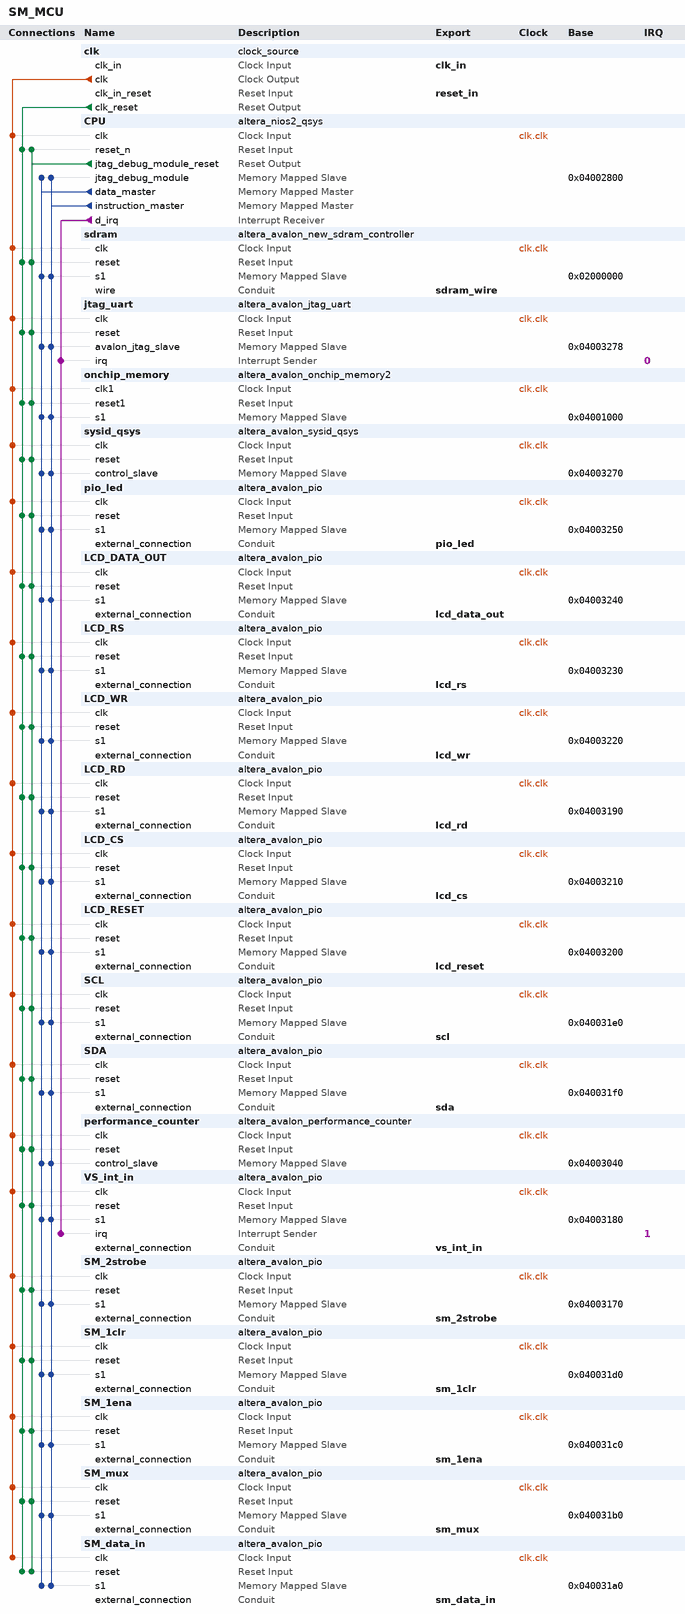
[diagram p0: system contents]
# Platform Designer (Qsys) system SM_MCU, Cyclone IV E EP4CE22F17C6
# Parameters at their usual value, and those the tool derives, are not listed.
package require -exact qsys 14.0
create_system SM_MCU
set_project_property DEVICE_FAMILY {Cyclone IV E}
set_project_property DEVICE EP4CE22F17C6

add_instance clk clock_source 14.0
set_instance_parameter_value clk clockFrequency 75000000

add_instance CPU altera_nios2_qsys 14.0
set_instance_parameter_value CPU resetrequest_enabled true
set_instance_parameter_value CPU resetSlave sdram.s1
set_instance_parameter_value CPU mmu_TLBMissExcSlave None
set_instance_parameter_value CPU exceptionSlave sdram.s1
set_instance_parameter_value CPU breakSlave CPU.jtag_debug_module
set_instance_parameter_value CPU impl Fast
set_instance_parameter_value CPU icache_size 4096

add_instance sdram altera_avalon_new_sdram_controller 14.0
set_instance_parameter_value sdram TAC 5.5
set_instance_parameter_value sdram TRCD 20.0
set_instance_parameter_value sdram TRP 20.0
set_instance_parameter_value sdram casLatency 3
set_instance_parameter_value sdram columnWidth 9
set_instance_parameter_value sdram dataWidth 16
set_instance_parameter_value sdram generateSimulationModel false
set_instance_parameter_value sdram initRefreshCommands 8
set_instance_parameter_value sdram model single_Micron_MT48LC4M32B2_7_chip
set_instance_parameter_value sdram numberOfBanks 4
set_instance_parameter_value sdram numberOfChipSelects 1
set_instance_parameter_value sdram powerUpDelay 200.0
set_instance_parameter_value sdram refreshPeriod 7.8125
set_instance_parameter_value sdram rowWidth 13

add_instance jtag_uart altera_avalon_jtag_uart 14.0
set_instance_parameter_value jtag_uart simInteractiveOptions NO_INTERACTIVE_WINDOWS

add_instance onchip_memory altera_avalon_onchip_memory2 14.0
set_instance_parameter_value onchip_memory dataWidth 32
set_instance_parameter_value onchip_memory dualPort false
set_instance_parameter_value onchip_memory initMemContent true
set_instance_parameter_value onchip_memory initializationFileName onchip_mem.hex
set_instance_parameter_value onchip_memory memorySize 4096

add_instance sysid_qsys altera_avalon_sysid_qsys 14.0
set_instance_parameter_value sysid_qsys id 0

add_instance pio_led altera_avalon_pio 14.0
set_instance_parameter_value pio_led direction Output
set_instance_parameter_value pio_led resetValue 1
set_instance_parameter_value pio_led width 2

add_instance LCD_DATA_OUT altera_avalon_pio 14.0
set_instance_parameter_value LCD_DATA_OUT direction Output
set_instance_parameter_value LCD_DATA_OUT width 16

add_instance LCD_RS altera_avalon_pio 14.0
set_instance_parameter_value LCD_RS direction Output
set_instance_parameter_value LCD_RS width 1

add_instance LCD_WR altera_avalon_pio 14.0
set_instance_parameter_value LCD_WR direction Output
set_instance_parameter_value LCD_WR width 1

add_instance LCD_RD altera_avalon_pio 14.0
set_instance_parameter_value LCD_RD direction Output
set_instance_parameter_value LCD_RD width 1

add_instance LCD_CS altera_avalon_pio 14.0
set_instance_parameter_value LCD_CS direction Output
set_instance_parameter_value LCD_CS width 1

add_instance LCD_RESET altera_avalon_pio 14.0
set_instance_parameter_value LCD_RESET direction Output
set_instance_parameter_value LCD_RESET width 1

add_instance SCL altera_avalon_pio 14.0
set_instance_parameter_value SCL direction Output
set_instance_parameter_value SCL resetValue 1
set_instance_parameter_value SCL width 1

add_instance SDA altera_avalon_pio 14.0
set_instance_parameter_value SDA direction Bidir
set_instance_parameter_value SDA resetValue 1
set_instance_parameter_value SDA width 1

add_instance performance_counter altera_avalon_performance_counter 14.0
set_instance_parameter_value performance_counter numberOfSections 3

add_instance VS_int_in altera_avalon_pio 14.0
set_instance_parameter_value VS_int_in bitClearingEdgeCapReg true
set_instance_parameter_value VS_int_in captureEdge true
set_instance_parameter_value VS_int_in direction Input
set_instance_parameter_value VS_int_in edgeType FALLING
set_instance_parameter_value VS_int_in generateIRQ true
set_instance_parameter_value VS_int_in irqType EDGE
set_instance_parameter_value VS_int_in width 2

add_instance SM_2strobe altera_avalon_pio 14.0
set_instance_parameter_value SM_2strobe direction Output
set_instance_parameter_value SM_2strobe width 1

add_instance SM_1clr altera_avalon_pio 14.0
set_instance_parameter_value SM_1clr direction Output
set_instance_parameter_value SM_1clr resetValue 1
set_instance_parameter_value SM_1clr width 1

add_instance SM_1ena altera_avalon_pio 14.0
set_instance_parameter_value SM_1ena direction Output
set_instance_parameter_value SM_1ena width 1

add_instance SM_mux altera_avalon_pio 14.0
set_instance_parameter_value SM_mux direction Output
set_instance_parameter_value SM_mux width 2

add_instance SM_data_in altera_avalon_pio 14.0
set_instance_parameter_value SM_data_in direction Input
set_instance_parameter_value SM_data_in simDrivenValue 69905
set_instance_parameter_value SM_data_in width 32

# connections
add_connection clk.clk CPU.clk clock
add_connection clk.clk jtag_uart.clk clock
add_connection clk.clk LCD_CS.clk clock
add_connection clk.clk LCD_DATA_OUT.clk clock
add_connection clk.clk LCD_RD.clk clock
add_connection clk.clk LCD_RESET.clk clock
add_connection clk.clk LCD_RS.clk clock
add_connection clk.clk LCD_WR.clk clock
add_connection clk.clk onchip_memory.clk1 clock
add_connection clk.clk performance_counter.clk clock
add_connection clk.clk pio_led.clk clock
add_connection clk.clk SCL.clk clock
add_connection clk.clk SDA.clk clock
add_connection clk.clk sdram.clk clock
add_connection clk.clk SM_1clr.clk clock
add_connection clk.clk SM_1ena.clk clock
add_connection clk.clk SM_2strobe.clk clock
add_connection clk.clk SM_data_in.clk clock
add_connection clk.clk SM_mux.clk clock
add_connection clk.clk sysid_qsys.clk clock
add_connection clk.clk VS_int_in.clk clock
add_connection clk.clk_reset CPU.reset_n reset
add_connection clk.clk_reset jtag_uart.reset reset
add_connection clk.clk_reset LCD_CS.reset reset
add_connection clk.clk_reset LCD_DATA_OUT.reset reset
add_connection clk.clk_reset LCD_RD.reset reset
add_connection clk.clk_reset LCD_RESET.reset reset
add_connection clk.clk_reset LCD_RS.reset reset
add_connection clk.clk_reset LCD_WR.reset reset
add_connection clk.clk_reset onchip_memory.reset1 reset
add_connection clk.clk_reset performance_counter.reset reset
add_connection clk.clk_reset pio_led.reset reset
add_connection clk.clk_reset SCL.reset reset
add_connection clk.clk_reset SDA.reset reset
add_connection clk.clk_reset sdram.reset reset
add_connection clk.clk_reset SM_1clr.reset reset
add_connection clk.clk_reset SM_1ena.reset reset
add_connection clk.clk_reset SM_2strobe.reset reset
add_connection clk.clk_reset SM_data_in.reset reset
add_connection clk.clk_reset SM_mux.reset reset
add_connection clk.clk_reset sysid_qsys.reset reset
add_connection clk.clk_reset VS_int_in.reset reset
add_connection CPU.jtag_debug_module_reset CPU.reset_n reset
add_connection CPU.jtag_debug_module_reset jtag_uart.reset reset
add_connection CPU.jtag_debug_module_reset LCD_CS.reset reset
add_connection CPU.jtag_debug_module_reset LCD_DATA_OUT.reset reset
add_connection CPU.jtag_debug_module_reset LCD_RD.reset reset
add_connection CPU.jtag_debug_module_reset LCD_RESET.reset reset
add_connection CPU.jtag_debug_module_reset LCD_RS.reset reset
add_connection CPU.jtag_debug_module_reset LCD_WR.reset reset
add_connection CPU.jtag_debug_module_reset onchip_memory.reset1 reset
add_connection CPU.jtag_debug_module_reset performance_counter.reset reset
add_connection CPU.jtag_debug_module_reset pio_led.reset reset
add_connection CPU.jtag_debug_module_reset SCL.reset reset
add_connection CPU.jtag_debug_module_reset SDA.reset reset
add_connection CPU.jtag_debug_module_reset sdram.reset reset
add_connection CPU.jtag_debug_module_reset SM_1clr.reset reset
add_connection CPU.jtag_debug_module_reset SM_1ena.reset reset
add_connection CPU.jtag_debug_module_reset SM_2strobe.reset reset
add_connection CPU.jtag_debug_module_reset SM_data_in.reset reset
add_connection CPU.jtag_debug_module_reset SM_mux.reset reset
add_connection CPU.jtag_debug_module_reset sysid_qsys.reset reset
add_connection CPU.jtag_debug_module_reset VS_int_in.reset reset
add_connection CPU.data_master CPU.jtag_debug_module avalon
set_connection_parameter_value CPU.data_master/CPU.jtag_debug_module baseAddress 0x04002800
add_connection CPU.data_master jtag_uart.avalon_jtag_slave avalon
set_connection_parameter_value CPU.data_master/jtag_uart.avalon_jtag_slave baseAddress 0x04003278
add_connection CPU.data_master LCD_CS.s1 avalon
set_connection_parameter_value CPU.data_master/LCD_CS.s1 baseAddress 0x04003210
add_connection CPU.data_master LCD_DATA_OUT.s1 avalon
set_connection_parameter_value CPU.data_master/LCD_DATA_OUT.s1 baseAddress 0x04003240
add_connection CPU.data_master LCD_RD.s1 avalon
set_connection_parameter_value CPU.data_master/LCD_RD.s1 baseAddress 0x04003190
add_connection CPU.data_master LCD_RESET.s1 avalon
set_connection_parameter_value CPU.data_master/LCD_RESET.s1 baseAddress 0x04003200
add_connection CPU.data_master LCD_RS.s1 avalon
set_connection_parameter_value CPU.data_master/LCD_RS.s1 baseAddress 0x04003230
add_connection CPU.data_master LCD_WR.s1 avalon
set_connection_parameter_value CPU.data_master/LCD_WR.s1 baseAddress 0x04003220
add_connection CPU.data_master onchip_memory.s1 avalon
set_connection_parameter_value CPU.data_master/onchip_memory.s1 baseAddress 0x04001000
add_connection CPU.data_master performance_counter.control_slave avalon
set_connection_parameter_value CPU.data_master/performance_counter.control_slave baseAddress 0x04003040
add_connection CPU.data_master pio_led.s1 avalon
set_connection_parameter_value CPU.data_master/pio_led.s1 baseAddress 0x04003250
add_connection CPU.data_master SCL.s1 avalon
set_connection_parameter_value CPU.data_master/SCL.s1 baseAddress 0x040031e0
add_connection CPU.data_master SDA.s1 avalon
set_connection_parameter_value CPU.data_master/SDA.s1 baseAddress 0x040031f0
add_connection CPU.data_master sdram.s1 avalon
set_connection_parameter_value CPU.data_master/sdram.s1 baseAddress 0x02000000
add_connection CPU.data_master SM_1clr.s1 avalon
set_connection_parameter_value CPU.data_master/SM_1clr.s1 baseAddress 0x040031d0
add_connection CPU.data_master SM_1ena.s1 avalon
set_connection_parameter_value CPU.data_master/SM_1ena.s1 baseAddress 0x040031c0
add_connection CPU.data_master SM_2strobe.s1 avalon
set_connection_parameter_value CPU.data_master/SM_2strobe.s1 baseAddress 0x04003170
add_connection CPU.data_master SM_data_in.s1 avalon
set_connection_parameter_value CPU.data_master/SM_data_in.s1 baseAddress 0x040031a0
add_connection CPU.data_master SM_mux.s1 avalon
set_connection_parameter_value CPU.data_master/SM_mux.s1 baseAddress 0x040031b0
add_connection CPU.data_master sysid_qsys.control_slave avalon
set_connection_parameter_value CPU.data_master/sysid_qsys.control_slave baseAddress 0x04003270
add_connection CPU.data_master VS_int_in.s1 avalon
set_connection_parameter_value CPU.data_master/VS_int_in.s1 baseAddress 0x04003180
add_connection CPU.instruction_master CPU.jtag_debug_module avalon
set_connection_parameter_value CPU.instruction_master/CPU.jtag_debug_module baseAddress 0x04002800
add_connection CPU.instruction_master jtag_uart.avalon_jtag_slave avalon
set_connection_parameter_value CPU.instruction_master/jtag_uart.avalon_jtag_slave baseAddress 0x04003278
add_connection CPU.instruction_master LCD_CS.s1 avalon
set_connection_parameter_value CPU.instruction_master/LCD_CS.s1 baseAddress 0x04003210
add_connection CPU.instruction_master LCD_DATA_OUT.s1 avalon
set_connection_parameter_value CPU.instruction_master/LCD_DATA_OUT.s1 baseAddress 0x04003240
add_connection CPU.instruction_master LCD_RD.s1 avalon
set_connection_parameter_value CPU.instruction_master/LCD_RD.s1 baseAddress 0x04003190
add_connection CPU.instruction_master LCD_RESET.s1 avalon
set_connection_parameter_value CPU.instruction_master/LCD_RESET.s1 baseAddress 0x04003200
add_connection CPU.instruction_master LCD_RS.s1 avalon
set_connection_parameter_value CPU.instruction_master/LCD_RS.s1 baseAddress 0x04003230
add_connection CPU.instruction_master LCD_WR.s1 avalon
set_connection_parameter_value CPU.instruction_master/LCD_WR.s1 baseAddress 0x04003220
add_connection CPU.instruction_master onchip_memory.s1 avalon
set_connection_parameter_value CPU.instruction_master/onchip_memory.s1 baseAddress 0x04001000
add_connection CPU.instruction_master performance_counter.control_slave avalon
set_connection_parameter_value CPU.instruction_master/performance_counter.control_slave baseAddress 0x04003040
add_connection CPU.instruction_master pio_led.s1 avalon
set_connection_parameter_value CPU.instruction_master/pio_led.s1 baseAddress 0x04003250
add_connection CPU.instruction_master SCL.s1 avalon
set_connection_parameter_value CPU.instruction_master/SCL.s1 baseAddress 0x040031e0
add_connection CPU.instruction_master SDA.s1 avalon
set_connection_parameter_value CPU.instruction_master/SDA.s1 baseAddress 0x040031f0
add_connection CPU.instruction_master sdram.s1 avalon
set_connection_parameter_value CPU.instruction_master/sdram.s1 baseAddress 0x02000000
add_connection CPU.instruction_master SM_1clr.s1 avalon
set_connection_parameter_value CPU.instruction_master/SM_1clr.s1 baseAddress 0x040031d0
add_connection CPU.instruction_master SM_1ena.s1 avalon
set_connection_parameter_value CPU.instruction_master/SM_1ena.s1 baseAddress 0x040031c0
add_connection CPU.instruction_master SM_2strobe.s1 avalon
set_connection_parameter_value CPU.instruction_master/SM_2strobe.s1 baseAddress 0x04003170
add_connection CPU.instruction_master SM_data_in.s1 avalon
set_connection_parameter_value CPU.instruction_master/SM_data_in.s1 baseAddress 0x040031a0
add_connection CPU.instruction_master SM_mux.s1 avalon
set_connection_parameter_value CPU.instruction_master/SM_mux.s1 baseAddress 0x040031b0
add_connection CPU.instruction_master sysid_qsys.control_slave avalon
set_connection_parameter_value CPU.instruction_master/sysid_qsys.control_slave baseAddress 0x04003270
add_connection CPU.instruction_master VS_int_in.s1 avalon
set_connection_parameter_value CPU.instruction_master/VS_int_in.s1 baseAddress 0x04003180
add_connection CPU.d_irq jtag_uart.irq interrupt
set_connection_parameter_value CPU.d_irq/jtag_uart.irq irqNumber 0
add_connection CPU.d_irq VS_int_in.irq interrupt
set_connection_parameter_value CPU.d_irq/VS_int_in.irq irqNumber 1

# exported interfaces
add_interface clk_in clock sink
set_interface_property clk_in EXPORT_OF clk.clk_in
add_interface reset_in reset sink
set_interface_property reset_in EXPORT_OF clk.clk_in_reset
add_interface sdram_wire conduit end
set_interface_property sdram_wire EXPORT_OF sdram.wire
add_interface pio_led conduit end
set_interface_property pio_led EXPORT_OF pio_led.external_connection
add_interface lcd_data_out conduit end
set_interface_property lcd_data_out EXPORT_OF LCD_DATA_OUT.external_connection
add_interface lcd_rs conduit end
set_interface_property lcd_rs EXPORT_OF LCD_RS.external_connection
add_interface lcd_wr conduit end
set_interface_property lcd_wr EXPORT_OF LCD_WR.external_connection
add_interface lcd_cs conduit end
set_interface_property lcd_cs EXPORT_OF LCD_CS.external_connection
add_interface lcd_rd conduit end
set_interface_property lcd_rd EXPORT_OF LCD_RD.external_connection
add_interface lcd_reset conduit end
set_interface_property lcd_reset EXPORT_OF LCD_RESET.external_connection
add_interface scl conduit end
set_interface_property scl EXPORT_OF SCL.external_connection
add_interface sda conduit end
set_interface_property sda EXPORT_OF SDA.external_connection
add_interface vs_int_in conduit end
set_interface_property vs_int_in EXPORT_OF VS_int_in.external_connection
add_interface sm_2strobe conduit end
set_interface_property sm_2strobe EXPORT_OF SM_2strobe.external_connection
add_interface sm_1clr conduit end
set_interface_property sm_1clr EXPORT_OF SM_1clr.external_connection
add_interface sm_1ena conduit end
set_interface_property sm_1ena EXPORT_OF SM_1ena.external_connection
add_interface sm_mux conduit end
set_interface_property sm_mux EXPORT_OF SM_mux.external_connection
add_interface sm_data_in conduit end
set_interface_property sm_data_in EXPORT_OF SM_data_in.external_connection

set_interconnect_requirement {$system} qsys_mm.clockCrossingAdapter HANDSHAKE
set_interconnect_requirement {$system} qsys_mm.maxAdditionalLatency 0

save_system SM_MCU.qsys
